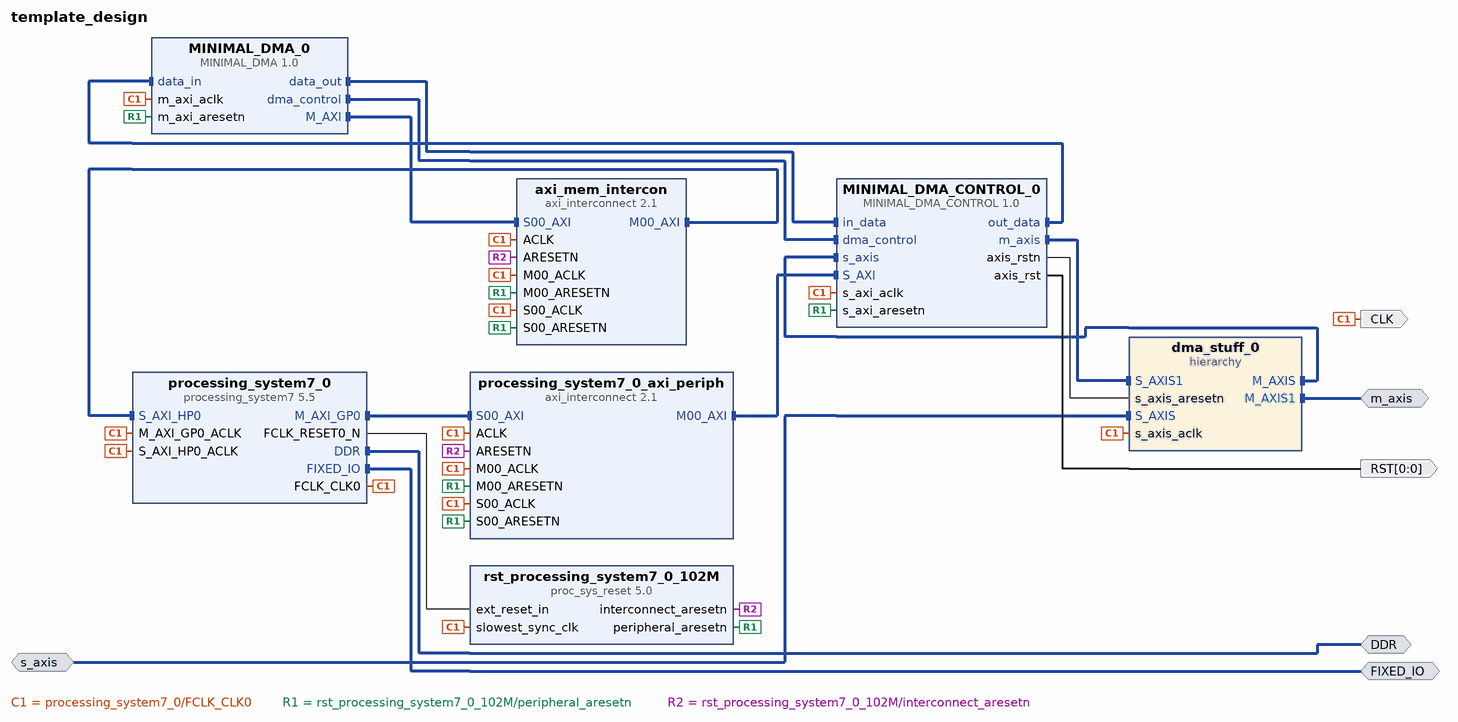
[diagram p0: block diagram of the top level]
# Vivado block design template_design, Vivado 2015.2
create_bd_design template_design

create_bd_intf_port -mode Master -vlnv xilinx.com:interface:ddrx_rtl:1.0 DDR
create_bd_intf_port -mode Master -vlnv xilinx.com:display_processing_system7:fixedio_rtl:1.0 FIXED_IO
create_bd_intf_port -mode Master -vlnv xilinx.com:interface:axis_rtl:1.0 m_axis
create_bd_intf_port -mode Slave -vlnv xilinx.com:interface:axis_rtl:1.0 s_axis
set_property -dict [list \
  CONFIG.TDATA_NUM_BYTES 4 \
  CONFIG.TDEST_WIDTH 0 \
  CONFIG.TID_WIDTH 0 \
  CONFIG.TUSER_WIDTH 0 \
  CONFIG.HAS_TREADY 1 \
  CONFIG.HAS_TSTRB 0 \
  CONFIG.HAS_TKEEP 0 \
  CONFIG.HAS_TLAST 1 \
  CONFIG.PHASE 0.000 \
  CONFIG.LAYERED_METADATA undef \
] [get_bd_intf_ports s_axis]
create_bd_port -dir O -type clk CLK
set_property -dict {CONFIG.ASSOCIATED_BUSIF s_axis:m_axis} [get_bd_ports CLK]
create_bd_port -dir O -from 0 -to 0 -type rst RST

create_bd_cell -type ip -vlnv xilinx.com:ip:processing_system7:5.5 processing_system7_0
set_property -dict [list \
  CONFIG.PCW_USE_S_AXI_HP0 1 \
  CONFIG.PCW_S_AXI_HP0_DATA_WIDTH 32 \
  CONFIG.preset ZedBoard \
] [get_bd_cells processing_system7_0]
create_bd_cell -type ip -vlnv xilinx.com:ip:axi_interconnect:2.1 processing_system7_0_axi_periph
set_property -dict {CONFIG.NUM_MI 1} [get_bd_cells processing_system7_0_axi_periph]
create_bd_cell -type ip -vlnv xilinx.com:ip:proc_sys_reset:5.0 rst_processing_system7_0_102M
create_bd_cell -type ip -vlnv xilinx.com:ip:axi_interconnect:2.1 axi_mem_intercon
set_property -dict {CONFIG.NUM_SI 1 CONFIG.NUM_MI 1} [get_bd_cells axi_mem_intercon]
create_bd_cell -type ip -vlnv fau.de:user:MINIMAL_DMA:1.0 MINIMAL_DMA_0
set_property -dict {CONFIG.C_M_AXI_BURST_LEN 16 CONFIG.LEN_WIDTH 26} [get_bd_cells MINIMAL_DMA_0]
create_bd_cell -type ip -vlnv user.org:user:MINIMAL_DMA_CONTROL:1.0 MINIMAL_DMA_CONTROL_0
set_property -dict {CONFIG.DMA_LEN_WIDTH 26 CONFIG.GEN_DONE true} [get_bd_cells MINIMAL_DMA_CONTROL_0]
create_bd_cell -type hier dma_stuff_0

# ---- hierarchy /dma_stuff_0 ----
current_bd_instance /dma_stuff_0
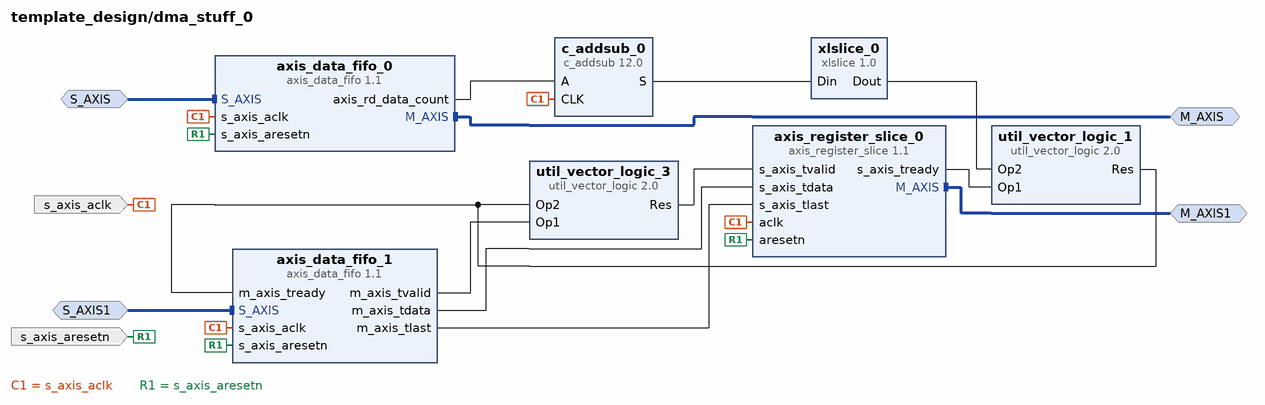
[diagram p1: block diagram inside /dma_stuff_0]
create_bd_intf_pin -mode Master -vlnv xilinx.com:interface:axis_rtl:1.0 M_AXIS1
create_bd_intf_pin -mode Slave -vlnv xilinx.com:interface:axis_rtl:1.0 S_AXIS1
create_bd_intf_pin -mode Master -vlnv xilinx.com:interface:axis_rtl:1.0 M_AXIS
create_bd_intf_pin -mode Slave -vlnv xilinx.com:interface:axis_rtl:1.0 S_AXIS
create_bd_pin -dir I -type clk s_axis_aclk
create_bd_pin -dir I -type rst s_axis_aresetn

create_bd_cell -type ip -vlnv xilinx.com:ip:c_addsub:12.0 c_addsub_0
set_property -dict [list \
  CONFIG.Implementation Fabric \
  CONFIG.A_Type Signed \
  CONFIG.B_Type Signed \
  CONFIG.A_Width 32 \
  CONFIG.B_Width 32 \
  CONFIG.Add_Mode Subtract \
  CONFIG.Out_Width 32 \
  CONFIG.Latency_Configuration Automatic \
  CONFIG.Latency 3 \
  CONFIG.B_Constant true \
  CONFIG.B_Value 00000000000000000000010111011100 \
  CONFIG.CE false \
  CONFIG.C_Out true \
] [get_bd_cells c_addsub_0]
create_bd_cell -type ip -vlnv xilinx.com:ip:util_vector_logic:2.0 util_vector_logic_1
set_property -dict {CONFIG.C_SIZE 1} [get_bd_cells util_vector_logic_1]
create_bd_cell -type ip -vlnv xilinx.com:ip:axis_register_slice:1.1 axis_register_slice_0
set_property -dict {CONFIG.TDATA_NUM_BYTES 4 CONFIG.HAS_TLAST 1} [get_bd_cells axis_register_slice_0]
create_bd_cell -type ip -vlnv xilinx.com:ip:axis_data_fifo:1.1 axis_data_fifo_1
set_property -dict {CONFIG.TDATA_NUM_BYTES 4 CONFIG.FIFO_DEPTH 2048 CONFIG.HAS_TLAST 1} [get_bd_cells axis_data_fifo_1]
create_bd_cell -type ip -vlnv xilinx.com:ip:util_vector_logic:2.0 util_vector_logic_3
set_property -dict {CONFIG.C_SIZE 1} [get_bd_cells util_vector_logic_3]
create_bd_cell -type ip -vlnv xilinx.com:ip:axis_data_fifo:1.1 axis_data_fifo_0
set_property -dict {CONFIG.TDATA_NUM_BYTES 4 CONFIG.FIFO_DEPTH 2048 CONFIG.HAS_TLAST 1} [get_bd_cells axis_data_fifo_0]
create_bd_cell -type ip -vlnv xilinx.com:ip:xlslice:1.0 xlslice_0
set_property -dict {CONFIG.DOUT_WIDTH 1 CONFIG.DIN_TO 31 CONFIG.DIN_FROM 31} [get_bd_cells xlslice_0]

# ---- connections ----

current_bd_instance /dma_stuff_0
connect_bd_intf_net [get_bd_intf_pins M_AXIS1] [get_bd_intf_pins axis_register_slice_0/M_AXIS]
connect_bd_intf_net [get_bd_intf_pins S_AXIS1] [get_bd_intf_pins axis_data_fifo_1/S_AXIS]
connect_bd_intf_net [get_bd_intf_pins M_AXIS] [get_bd_intf_pins axis_data_fifo_0/M_AXIS]
connect_bd_intf_net [get_bd_intf_pins S_AXIS] [get_bd_intf_pins axis_data_fifo_0/S_AXIS]
connect_bd_net [get_bd_pins s_axis_aclk] \
  [get_bd_pins c_addsub_0/CLK] [get_bd_pins axis_register_slice_0/aclk] [get_bd_pins axis_data_fifo_1/s_axis_aclk] \
  [get_bd_pins axis_data_fifo_0/s_axis_aclk]
connect_bd_net [get_bd_pins util_vector_logic_1/Res] [get_bd_pins axis_data_fifo_1/m_axis_tready] [get_bd_pins util_vector_logic_3/Op2]
connect_bd_net [get_bd_pins axis_register_slice_0/s_axis_tready] [get_bd_pins util_vector_logic_1/Op1]
connect_bd_net [get_bd_pins axis_data_fifo_1/m_axis_tdata] [get_bd_pins axis_register_slice_0/s_axis_tdata]
connect_bd_net [get_bd_pins axis_data_fifo_1/m_axis_tlast] [get_bd_pins axis_register_slice_0/s_axis_tlast]
connect_bd_net [get_bd_pins util_vector_logic_3/Res] [get_bd_pins axis_register_slice_0/s_axis_tvalid]
connect_bd_net [get_bd_pins axis_data_fifo_1/m_axis_tvalid] [get_bd_pins util_vector_logic_3/Op1]
connect_bd_net [get_bd_pins axis_data_fifo_0/axis_rd_data_count] [get_bd_pins c_addsub_0/A]
connect_bd_net [get_bd_pins c_addsub_0/S] [get_bd_pins xlslice_0/Din]
connect_bd_net [get_bd_pins xlslice_0/Dout] [get_bd_pins util_vector_logic_1/Op2]
connect_bd_net [get_bd_pins s_axis_aresetn] \
  [get_bd_pins axis_data_fifo_0/s_axis_aresetn] [get_bd_pins axis_data_fifo_1/s_axis_aresetn] \
  [get_bd_pins axis_register_slice_0/aresetn]

current_bd_instance /
connect_bd_intf_net [get_bd_intf_pins processing_system7_0/M_AXI_GP0] [get_bd_intf_pins processing_system7_0_axi_periph/S00_AXI]
connect_bd_intf_net [get_bd_intf_pins axi_mem_intercon/M00_AXI] [get_bd_intf_pins processing_system7_0/S_AXI_HP0]
connect_bd_intf_net [get_bd_intf_pins MINIMAL_DMA_CONTROL_0/out_data] [get_bd_intf_pins MINIMAL_DMA_0/data_in]
connect_bd_intf_net [get_bd_intf_pins MINIMAL_DMA_CONTROL_0/in_data] [get_bd_intf_pins MINIMAL_DMA_0/data_out]
connect_bd_intf_net [get_bd_intf_pins MINIMAL_DMA_0/M_AXI] [get_bd_intf_pins axi_mem_intercon/S00_AXI]
connect_bd_intf_net [get_bd_intf_pins MINIMAL_DMA_CONTROL_0/S_AXI] [get_bd_intf_pins processing_system7_0_axi_periph/M00_AXI]
connect_bd_intf_net [get_bd_intf_pins MINIMAL_DMA_0/dma_control] [get_bd_intf_pins MINIMAL_DMA_CONTROL_0/dma_control]
connect_bd_intf_net [get_bd_intf_pins MINIMAL_DMA_CONTROL_0/m_axis] [get_bd_intf_pins dma_stuff_0/S_AXIS1]
connect_bd_intf_net [get_bd_intf_pins MINIMAL_DMA_CONTROL_0/s_axis] [get_bd_intf_pins dma_stuff_0/M_AXIS]
connect_bd_intf_net [get_bd_intf_ports DDR] [get_bd_intf_pins processing_system7_0/DDR]
connect_bd_intf_net [get_bd_intf_ports FIXED_IO] [get_bd_intf_pins processing_system7_0/FIXED_IO]
connect_bd_intf_net [get_bd_intf_ports m_axis] [get_bd_intf_pins dma_stuff_0/M_AXIS1]
connect_bd_intf_net [get_bd_intf_ports s_axis] [get_bd_intf_pins dma_stuff_0/S_AXIS]
connect_bd_net [get_bd_pins processing_system7_0/FCLK_CLK0] \
  [get_bd_ports CLK] [get_bd_pins processing_system7_0/M_AXI_GP0_ACLK] \
  [get_bd_pins rst_processing_system7_0_102M/slowest_sync_clk] [get_bd_pins processing_system7_0/S_AXI_HP0_ACLK] \
  [get_bd_pins MINIMAL_DMA_0/m_axi_aclk] [get_bd_pins MINIMAL_DMA_CONTROL_0/s_axi_aclk] \
  [get_bd_pins processing_system7_0_axi_periph/S00_ACLK] [get_bd_pins processing_system7_0_axi_periph/ACLK] \
  [get_bd_pins processing_system7_0_axi_periph/M00_ACLK] [get_bd_pins axi_mem_intercon/S00_ACLK] \
  [get_bd_pins axi_mem_intercon/ACLK] [get_bd_pins axi_mem_intercon/M00_ACLK] [get_bd_pins dma_stuff_0/s_axis_aclk]
connect_bd_net [get_bd_pins processing_system7_0/FCLK_RESET0_N] [get_bd_pins rst_processing_system7_0_102M/ext_reset_in]
connect_bd_net [get_bd_pins rst_processing_system7_0_102M/peripheral_aresetn] \
  [get_bd_pins MINIMAL_DMA_0/m_axi_aresetn] [get_bd_pins MINIMAL_DMA_CONTROL_0/s_axi_aresetn] \
  [get_bd_pins processing_system7_0_axi_periph/S00_ARESETN] [get_bd_pins processing_system7_0_axi_periph/M00_ARESETN] \
  [get_bd_pins axi_mem_intercon/S00_ARESETN] [get_bd_pins axi_mem_intercon/M00_ARESETN]
connect_bd_net [get_bd_pins rst_processing_system7_0_102M/interconnect_aresetn] \
  [get_bd_pins processing_system7_0_axi_periph/ARESETN] [get_bd_pins axi_mem_intercon/ARESETN]
connect_bd_net [get_bd_pins MINIMAL_DMA_CONTROL_0/axis_rstn] [get_bd_pins dma_stuff_0/s_axis_aresetn]
connect_bd_net [get_bd_pins MINIMAL_DMA_CONTROL_0/axis_rst] [get_bd_ports RST]

# ---- address map ----
assign_bd_address -offset 0x00000000 -range 512M -target_address_space [get_bd_addr_spaces MINIMAL_DMA_0/M_AXI] [get_bd_addr_segs processing_system7_0/S_AXI_HP0/HP0_DDR_LOWOCM]
assign_bd_address -offset 0x43C00000 -range 64K -target_address_space [get_bd_addr_spaces processing_system7_0/Data] [get_bd_addr_segs MINIMAL_DMA_CONTROL_0/S_AXI/S_AXI_reg]

validate_bd_design
save_bd_design
